# EAGLE schematic Input interface (EAGLE 7.1.0)
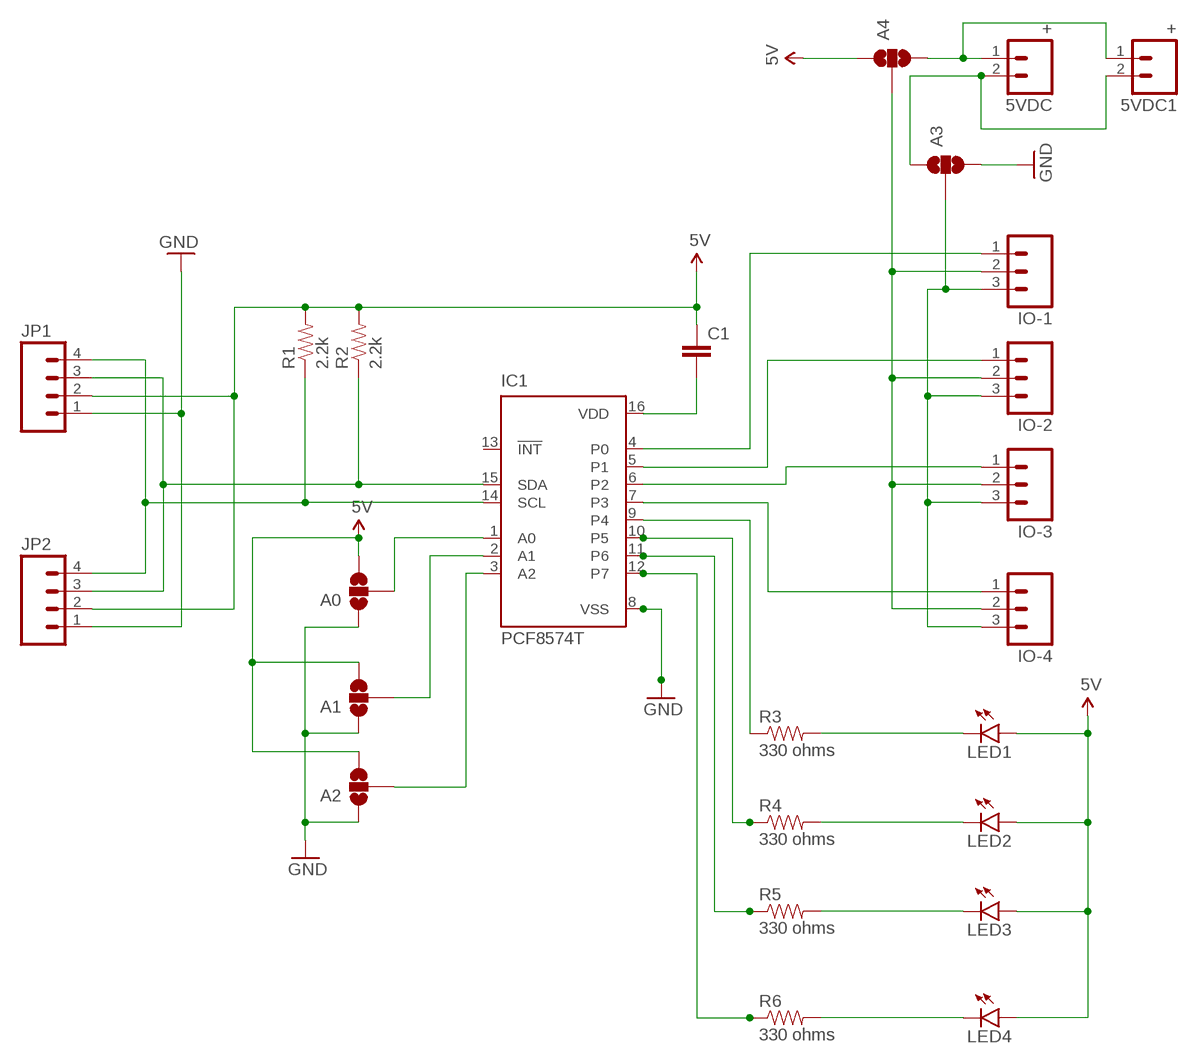
[diagram p0: schematic, sheet 1]

## Parts
5VDC  +  M02PTH  [1X02]
5VDC1  +  M02PTH  [1X02]
A0  SOLDERJUMPER_2WAYS  [SJ_3]
A1  SOLDERJUMPER_2WAYS  [SJ_3]
A2  SOLDERJUMPER_2WAYS  [SJ_3]
A3  SOLDERJUMPER_2WAYS  [SJ_3]
A4  SOLDERJUMPER_2WAYS  [SJ_3]
C1  CAPPTH2  [CAP-PTH-SMALL2]
IC1  PCF8574T  [SO16W]
IO-1  M03PTH  [1X03]
IO-2  M03PTH  [1X03]
IO-3  M03PTH  [1X03]
IO-4  M03PTH  [1X03]
JP1  M04PTH  [1X04]
JP2  M04PTH  [1X04]
LED1  LED3MM  [LED3MM]
LED2  LED3MM  [LED3MM]
LED3  LED3MM  [LED3MM]
LED4  LED3MM  [LED3MM]
R1  2.2k  RESISTORAXIAL-0.3  [AXIAL-0.3]
R2  2.2k  RESISTORAXIAL-0.3  [AXIAL-0.3]
R3  330 ohms  RESISTORAXIAL-0.3  [AXIAL-0.3]
R4  330 ohms  RESISTORAXIAL-0.3  [AXIAL-0.3]
R5  330 ohms  RESISTORAXIAL-0.3  [AXIAL-0.3]
R6  330 ohms  RESISTORAXIAL-0.3  [AXIAL-0.3]

## Nets
5V: A0.3 A1.3 A2.3 A4.1 C1.1 JP1.2 JP2.2 LED1.A LED2.A LED3.A LED4.A R1.P$2 R2.P$2
GND: A0.1 A1.1 A2.1 A3.3 IC1.8(VSS) JP1.1 JP2.1
N$1: IC1.4(P0) IO-1.1
N$2: IC1.5(P1) IO-2.1
N$3: IC1.6(P2) IO-3.1
N$4: A0.2 IC1.1(A0)
N$5: IC1.14(SCL) JP1.4 JP2.4 R1.P$1
N$6: IC1.15(SDA) JP1.3 JP2.3 R2.P$1
N$7: A1.2 IC1.2(A1)
N$8: C1.2 IC1.16(VDD)
N$9: A2.2 IC1.3(A2)
N$10: IC1.7(P3) IO-4.1
N$11: IC1.9(P4) R3.P$1
N$12: IC1.10(P5) R4.P$1
N$13: IC1.11(P6) R5.P$1
N$14: IC1.12(P7) R6.P$1
N$15: LED1.K(C) R3.P$2
N$16: LED2.K(C) R4.P$2
N$17: LED3.K(C) R5.P$2
N$18: LED4.K(C) R6.P$2
N$19: A4.2 IO-1.2 IO-2.2 IO-3.2 IO-4.2
N$20: 5VDC1.1 5VDC.1 A4.3
N$21: 5VDC1.2 5VDC.2 A3.1
N$22: A3.2 IO-1.3 IO-2.3 IO-3.3 IO-4.3
Unconnected: IC1.13(!INT)

## Library data of the parts
5VDC 5VDC1 = SparkFun-Connectors:M02: Standard 2-pin 0.1" header. Use with - straight break away headers ( PRT-00116) - right angle break away headers (PRT-00553) - swiss pins (PRT-00743) - machine pins (PRT-00117) - female headers (PRT-00115) Molex polarized connector foot print use with: PRT-08233 with associated crimp pins and housings. 2.54_SCREWTERM for use with PRT-10571. 3.5mm Screw Terminal footprints for PRT-08084 5mm Screw Terminal footprints for use with PRT-08432
A0 A1-A4 = SparkFun-Retired:SOLDERJUMPER_2WAY: Solder Jumper 2 way solder jumper
C1 = SparkFun-Capacitors:CAP: Capacitor Standard 0603 ceramic capacitor, and 0.1" leaded capacitor.
IC1 = micro-philips:PCF8574: I2C-Bus Remote 8-bit I/O expander http://www.semiconductors.philips.com/acrobat_download/datasheets/PCF8574_4.pdf
IO-1-IO-4 = SparkFun-Connectors:M03: Header 3 Standard 3-pin 0.1" header. Use with straight break away headers (SKU : PRT-00116), right angle break away headers (PRT-00553), swiss pins (PRT-00743), machine pins (PRT-00117), and female headers (PRT-00115). Molex polarized connector foot print use with SKU : PRT-08232 with associated crimp pins and housings.
JP1 JP2 = SparkFun-Connectors:M04: Header 4 Standard 4-pin 0.1" header. Use with straight break away headers (SKU : PRT-00116), right angle break away headers (PRT-00553), swiss pins (PRT-00743), machine pins (PRT-00117), and female headers (PRT-00115). Molex polarized connector foot print use with SKU : PRT-08231 with associated crimp pins and housings. 1MM SMD Version SKU: PRT-10208
LED1-LED4 = SparkFun-LED:LED: LEDs Standard schematic elements and footprints for 5mm, 3mm, 1206, and 0603 sized LEDs. 5mm - Spark Fun Electronics SKU : COM-00529 (and others)
R1-R6 = SparkFun-Resistors:RESISTOR: Resistor Basic schematic elements and footprints for 0603, 1206, and PTH resistors.